# Vivado block design design_1, xczu28dr-ffvg1517-2-e, Vivado 2021.1
# (continued, part 4 of 8)
current_bd_instance /chan4/psb_out_post

# ---- hierarchy /chan4/fine_nco ----
current_bd_instance /chan4/fine_nco
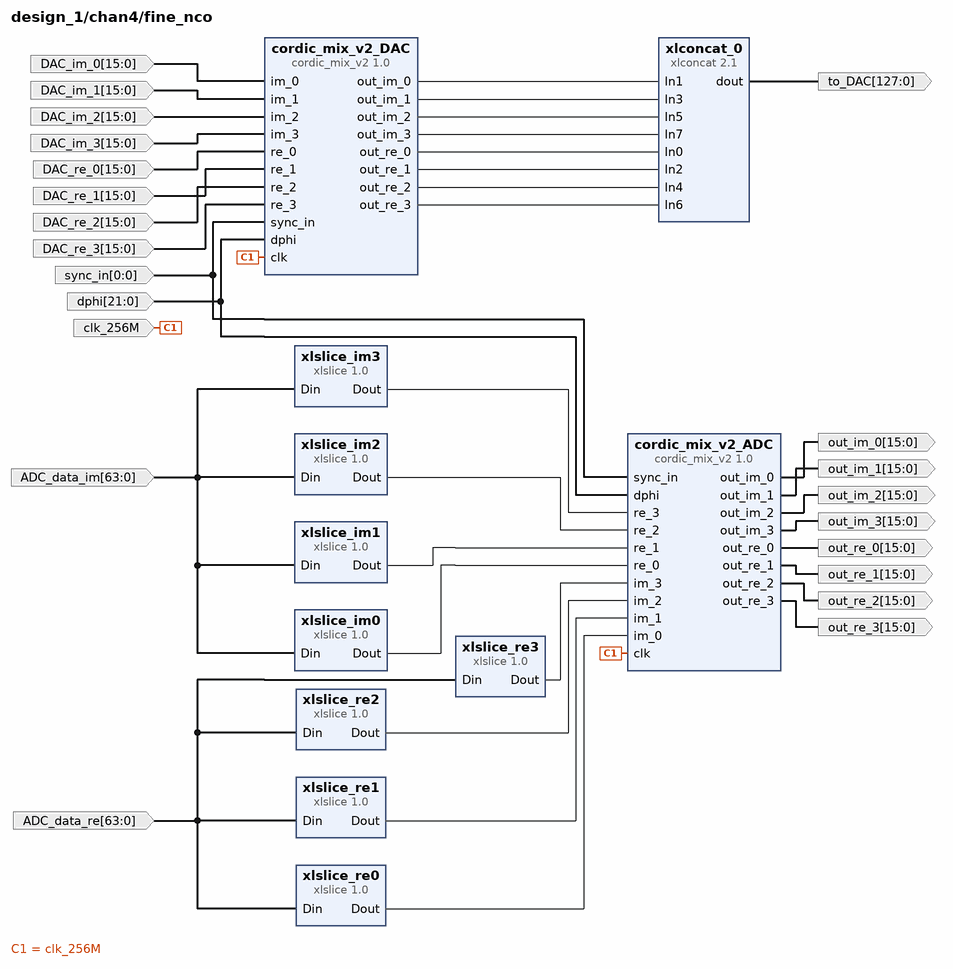
[diagram p30: block diagram inside /chan4/fine_nco]
create_bd_pin -dir I -from 63 -to 0 ADC_data_im
create_bd_pin -dir O -from 127 -to 0 to_DAC
create_bd_pin -dir I -from 63 -to 0 ADC_data_re
create_bd_pin -dir I -from 21 -to 0 dphi
create_bd_pin -dir I -from 0 -to 0 sync_in
create_bd_pin -dir I -type clk clk_256M
create_bd_pin -dir O -from 15 -to 0 out_im_0
create_bd_pin -dir O -from 15 -to 0 out_im_1
create_bd_pin -dir O -from 15 -to 0 out_im_2
create_bd_pin -dir O -from 15 -to 0 out_im_3
create_bd_pin -dir O -from 15 -to 0 out_re_0
create_bd_pin -dir O -from 15 -to 0 out_re_1
create_bd_pin -dir O -from 15 -to 0 out_re_2
create_bd_pin -dir O -from 15 -to 0 out_re_3
create_bd_pin -dir I -from 15 -to 0 DAC_im_0
create_bd_pin -dir I -from 15 -to 0 DAC_im_1
create_bd_pin -dir I -from 15 -to 0 DAC_im_2
create_bd_pin -dir I -from 15 -to 0 DAC_im_3
create_bd_pin -dir I -from 15 -to 0 DAC_re_0
create_bd_pin -dir I -from 15 -to 0 DAC_re_1
create_bd_pin -dir I -from 15 -to 0 DAC_re_2
create_bd_pin -dir I -from 15 -to 0 DAC_re_3

create_bd_cell -type ip -vlnv xilinx.com:ip:xlslice:1.0 xlslice_im0
set_property -dict {CONFIG.DIN_FROM 15 CONFIG.DIN_TO 0 CONFIG.DIN_WIDTH 64 CONFIG.DOUT_WIDTH 16} [get_bd_cells xlslice_im0]
create_bd_cell -type ip -vlnv xilinx.com:ip:xlslice:1.0 xlslice_im1
set_property -dict {CONFIG.DIN_FROM 31 CONFIG.DIN_TO 16 CONFIG.DIN_WIDTH 64 CONFIG.DOUT_WIDTH 16} [get_bd_cells xlslice_im1]
create_bd_cell -type ip -vlnv xilinx.com:ip:xlslice:1.0 xlslice_im2
set_property -dict {CONFIG.DIN_FROM 47 CONFIG.DIN_TO 32 CONFIG.DIN_WIDTH 64 CONFIG.DOUT_WIDTH 16} [get_bd_cells xlslice_im2]
create_bd_cell -type ip -vlnv xilinx.com:ip:xlconcat:2.1 xlconcat_0
set_property -dict [list \
  CONFIG.IN2_WIDTH 16 \
  CONFIG.IN3_WIDTH 16 \
  CONFIG.IN4_WIDTH 16 \
  CONFIG.IN5_WIDTH 16 \
  CONFIG.IN6_WIDTH 16 \
  CONFIG.IN7_WIDTH 16 \
  CONFIG.NUM_PORTS 8 \
] [get_bd_cells xlconcat_0]
create_bd_cell -type ip -vlnv xilinx.com:ip:xlslice:1.0 xlslice_re0
set_property -dict {CONFIG.DIN_FROM 15 CONFIG.DIN_TO 0 CONFIG.DIN_WIDTH 64 CONFIG.DOUT_WIDTH 16} [get_bd_cells xlslice_re0]
create_bd_cell -type ip -vlnv xilinx.com:ip:xlslice:1.0 xlslice_im3
set_property -dict {CONFIG.DIN_FROM 63 CONFIG.DIN_TO 48 CONFIG.DIN_WIDTH 64 CONFIG.DOUT_WIDTH 16} [get_bd_cells xlslice_im3]
create_bd_cell -type ip -vlnv xilinx.com:ip:xlslice:1.0 xlslice_re1
set_property -dict {CONFIG.DIN_FROM 31 CONFIG.DIN_TO 16 CONFIG.DIN_WIDTH 64 CONFIG.DOUT_WIDTH 16} [get_bd_cells xlslice_re1]
create_bd_cell -type ip -vlnv xilinx.com:ip:xlslice:1.0 xlslice_re2
set_property -dict {CONFIG.DIN_FROM 47 CONFIG.DIN_TO 32 CONFIG.DIN_WIDTH 64 CONFIG.DOUT_WIDTH 16} [get_bd_cells xlslice_re2]
create_bd_cell -type ip -vlnv xilinx.com:user:cordic_mix_v2:1.0 cordic_mix_v2_ADC
create_bd_cell -type ip -vlnv xilinx.com:user:cordic_mix_v2:1.0 cordic_mix_v2_DAC
create_bd_cell -type ip -vlnv xilinx.com:ip:xlslice:1.0 xlslice_re3
set_property -dict {CONFIG.DIN_FROM 63 CONFIG.DIN_TO 48 CONFIG.DIN_WIDTH 64 CONFIG.DOUT_WIDTH 16} [get_bd_cells xlslice_re3]

# ---- hierarchy /chan4/overflow_management ----
current_bd_instance /chan4/overflow_management
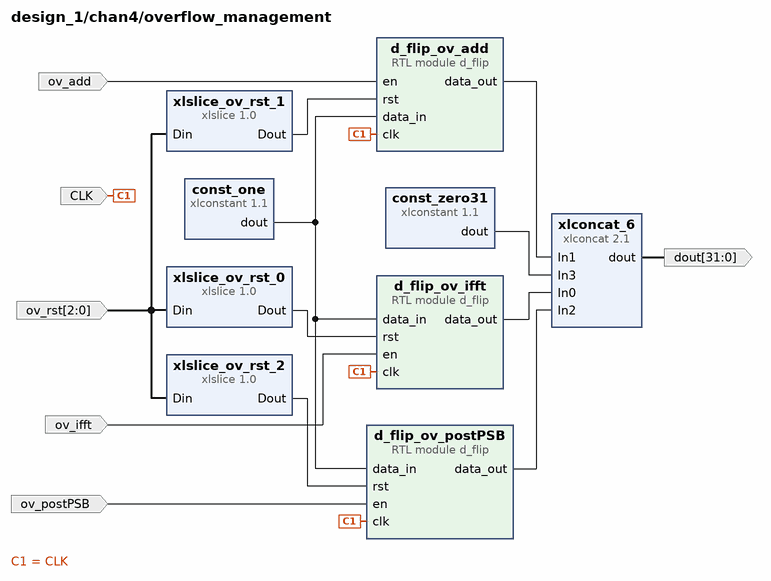
[diagram p31: block diagram inside /chan4/overflow_management]
create_bd_pin -dir I -type clk CLK
create_bd_pin -dir O -from 31 -to 0 dout
create_bd_pin -dir I ov_add
create_bd_pin -dir I ov_ifft
create_bd_pin -dir I ov_postPSB
create_bd_pin -dir I -from 2 -to 0 ov_rst

create_bd_cell -type ip -vlnv xilinx.com:ip:xlconstant:1.1 const_one
set_property -dict {CONFIG.CONST_VAL 1 CONFIG.CONST_WIDTH 1} [get_bd_cells const_one]
create_bd_cell -type ip -vlnv xilinx.com:ip:xlconstant:1.1 const_zero31
set_property -dict {CONFIG.CONST_VAL 0 CONFIG.CONST_WIDTH 29} [get_bd_cells const_zero31]
create_bd_cell -type module -reference d_flip d_flip_ov_add
set_property -dict {CONFIG.width 1} [get_bd_cells d_flip_ov_add]
create_bd_cell -type module -reference d_flip d_flip_ov_ifft
set_property -dict {CONFIG.width 1} [get_bd_cells d_flip_ov_ifft]
create_bd_cell -type module -reference d_flip d_flip_ov_postPSB
set_property -dict {CONFIG.width 1} [get_bd_cells d_flip_ov_postPSB]
create_bd_cell -type ip -vlnv xilinx.com:ip:xlconcat:2.1 xlconcat_6
set_property -dict [list \
  CONFIG.IN0_WIDTH 1 \
  CONFIG.IN1_WIDTH 1 \
  CONFIG.IN2_WIDTH 1 \
  CONFIG.IN3_WIDTH 29 \
  CONFIG.IN4_WIDTH 16 \
  CONFIG.IN5_WIDTH 16 \
  CONFIG.IN6_WIDTH 16 \
  CONFIG.IN7_WIDTH 16 \
  CONFIG.NUM_PORTS 4 \
] [get_bd_cells xlconcat_6]
create_bd_cell -type ip -vlnv xilinx.com:ip:xlslice:1.0 xlslice_ov_rst_0
set_property -dict {CONFIG.DIN_FROM 0 CONFIG.DIN_TO 0 CONFIG.DIN_WIDTH 3 CONFIG.DOUT_WIDTH 1} [get_bd_cells xlslice_ov_rst_0]
create_bd_cell -type ip -vlnv xilinx.com:ip:xlslice:1.0 xlslice_ov_rst_1
set_property -dict {CONFIG.DIN_FROM 1 CONFIG.DIN_TO 1 CONFIG.DIN_WIDTH 3 CONFIG.DOUT_WIDTH 1} [get_bd_cells xlslice_ov_rst_1]
create_bd_cell -type ip -vlnv xilinx.com:ip:xlslice:1.0 xlslice_ov_rst_2
set_property -dict {CONFIG.DIN_FROM 2 CONFIG.DIN_TO 2 CONFIG.DIN_WIDTH 3 CONFIG.DOUT_WIDTH 1} [get_bd_cells xlslice_ov_rst_2]

# ---- hierarchy /ethWrapPort1 ----
current_bd_instance /ethWrapPort1
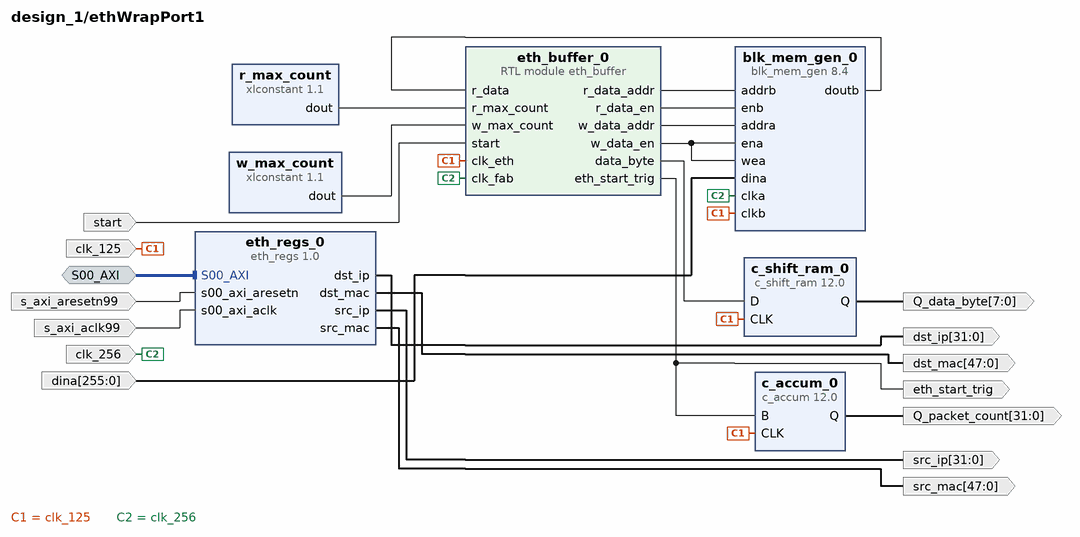
[diagram p32: block diagram inside /ethWrapPort1]
create_bd_intf_pin -mode Slave -vlnv xilinx.com:interface:aximm_rtl:1.0 S00_AXI
create_bd_pin -dir I start
create_bd_pin -dir I -type clk clk_256
create_bd_pin -dir I -type clk clk_125
create_bd_pin -dir I -type rst s_axi_aresetn99
create_bd_pin -dir O eth_start_trig
create_bd_pin -dir O -from 31 -to 0 src_ip
create_bd_pin -dir O -from 47 -to 0 src_mac
create_bd_pin -dir O -from 31 -to 0 dst_ip
create_bd_pin -dir O -from 47 -to 0 dst_mac
create_bd_pin -dir O -from 7 -to 0 -type data Q_data_byte
create_bd_pin -dir O -from 31 -to 0 -type data Q_packet_count
create_bd_pin -dir I s_axi_aclk99
create_bd_pin -dir I -from 255 -to 0 dina

create_bd_cell -type ip -vlnv xilinx.com:ip:xlconstant:1.1 w_max_count
set_property -dict {CONFIG.CONST_VAL 512 CONFIG.CONST_WIDTH 10} [get_bd_cells w_max_count]
create_bd_cell -type ip -vlnv xilinx.com:ip:blk_mem_gen:8.4 blk_mem_gen_0
set_property -dict [list \
  CONFIG.Enable_32bit_Address false \
  CONFIG.Enable_B Use_ENB_Pin \
  CONFIG.Memory_Type Simple_Dual_Port_RAM \
  CONFIG.Operating_Mode_A NO_CHANGE \
  CONFIG.Port_B_Clock 100 \
  CONFIG.Port_B_Enable_Rate 100 \
  CONFIG.Read_Width_B 256 \
  CONFIG.Register_PortB_Output_of_Memory_Primitives true \
  CONFIG.Use_Byte_Write_Enable false \
  CONFIG.Write_Depth_A 1024 \
  CONFIG.Write_Width_A 256 \
  CONFIG.Write_Width_B 256 \
  CONFIG.use_bram_block Stand_Alone \
] [get_bd_cells blk_mem_gen_0]
create_bd_cell -type ip -vlnv xilinx.com:ip:xlconstant:1.1 r_max_count
set_property -dict {CONFIG.CONST_VAL 16383 CONFIG.CONST_WIDTH 15} [get_bd_cells r_max_count]
create_bd_cell -type ip -vlnv xilinx.com:ip:c_shift_ram:12.0 c_shift_ram_0
set_property -dict [list \
  CONFIG.AsyncInitVal 00000000 \
  CONFIG.DefaultData 00000000 \
  CONFIG.Depth 42 \
  CONFIG.Width 8 \
] [get_bd_cells c_shift_ram_0]
create_bd_cell -type ip -vlnv xilinx.com:ip:c_accum:12.0 c_accum_0
set_property -dict [list \
  CONFIG.Bypass false \
  CONFIG.Input_Type Unsigned \
  CONFIG.Input_Width 1 \
  CONFIG.Output_Width 32 \
] [get_bd_cells c_accum_0]
create_bd_cell -type ip -vlnv user.org:user:eth_regs:1.0 eth_regs_0
create_bd_cell -type module -reference eth_buffer eth_buffer_0

# ---- hierarchy /ethWrapPort2 ----
current_bd_instance /ethWrapPort2
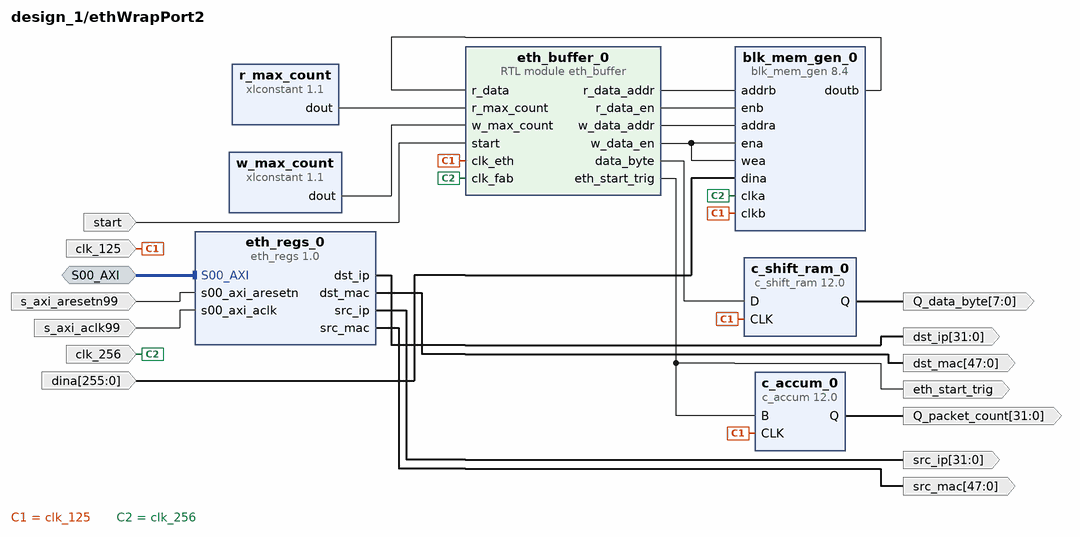
[diagram p33: block diagram inside /ethWrapPort2]
create_bd_intf_pin -mode Slave -vlnv xilinx.com:interface:aximm_rtl:1.0 S00_AXI
create_bd_pin -dir I start
create_bd_pin -dir I -type clk clk_256
create_bd_pin -dir I -type clk clk_125
create_bd_pin -dir I -type rst s_axi_aresetn99
create_bd_pin -dir O eth_start_trig
create_bd_pin -dir O -from 31 -to 0 src_ip
create_bd_pin -dir O -from 47 -to 0 src_mac
create_bd_pin -dir O -from 31 -to 0 dst_ip
create_bd_pin -dir O -from 47 -to 0 dst_mac
create_bd_pin -dir O -from 7 -to 0 -type data Q_data_byte
create_bd_pin -dir O -from 31 -to 0 -type data Q_packet_count
create_bd_pin -dir I s_axi_aclk99
create_bd_pin -dir I -from 255 -to 0 dina

create_bd_cell -type ip -vlnv xilinx.com:ip:xlconstant:1.1 w_max_count
set_property -dict {CONFIG.CONST_VAL 512 CONFIG.CONST_WIDTH 10} [get_bd_cells w_max_count]
create_bd_cell -type ip -vlnv xilinx.com:ip:blk_mem_gen:8.4 blk_mem_gen_0
set_property -dict [list \
  CONFIG.Enable_32bit_Address false \
  CONFIG.Enable_B Use_ENB_Pin \
  CONFIG.Memory_Type Simple_Dual_Port_RAM \
  CONFIG.Operating_Mode_A NO_CHANGE \
  CONFIG.Port_B_Clock 100 \
  CONFIG.Port_B_Enable_Rate 100 \
  CONFIG.Read_Width_B 256 \
  CONFIG.Register_PortB_Output_of_Memory_Primitives true \
  CONFIG.Use_Byte_Write_Enable false \
  CONFIG.Write_Depth_A 1024 \
  CONFIG.Write_Width_A 256 \
  CONFIG.Write_Width_B 256 \
  CONFIG.use_bram_block Stand_Alone \
] [get_bd_cells blk_mem_gen_0]
create_bd_cell -type ip -vlnv xilinx.com:ip:xlconstant:1.1 r_max_count
set_property -dict {CONFIG.CONST_VAL 16383 CONFIG.CONST_WIDTH 15} [get_bd_cells r_max_count]
create_bd_cell -type ip -vlnv xilinx.com:ip:c_shift_ram:12.0 c_shift_ram_0
set_property -dict [list \
  CONFIG.AsyncInitVal 00000000 \
  CONFIG.DefaultData 00000000 \
  CONFIG.Depth 42 \
  CONFIG.Width 8 \
] [get_bd_cells c_shift_ram_0]
create_bd_cell -type ip -vlnv xilinx.com:ip:c_accum:12.0 c_accum_0
set_property -dict [list \
  CONFIG.Bypass false \
  CONFIG.Input_Type Unsigned \
  CONFIG.Input_Width 1 \
  CONFIG.Output_Width 32 \
] [get_bd_cells c_accum_0]
create_bd_cell -type ip -vlnv user.org:user:eth_regs:1.0 eth_regs_0
create_bd_cell -type module -reference eth_buffer eth_buffer_0

# ---- hierarchy /ethWrapPort3 ----
current_bd_instance /ethWrapPort3
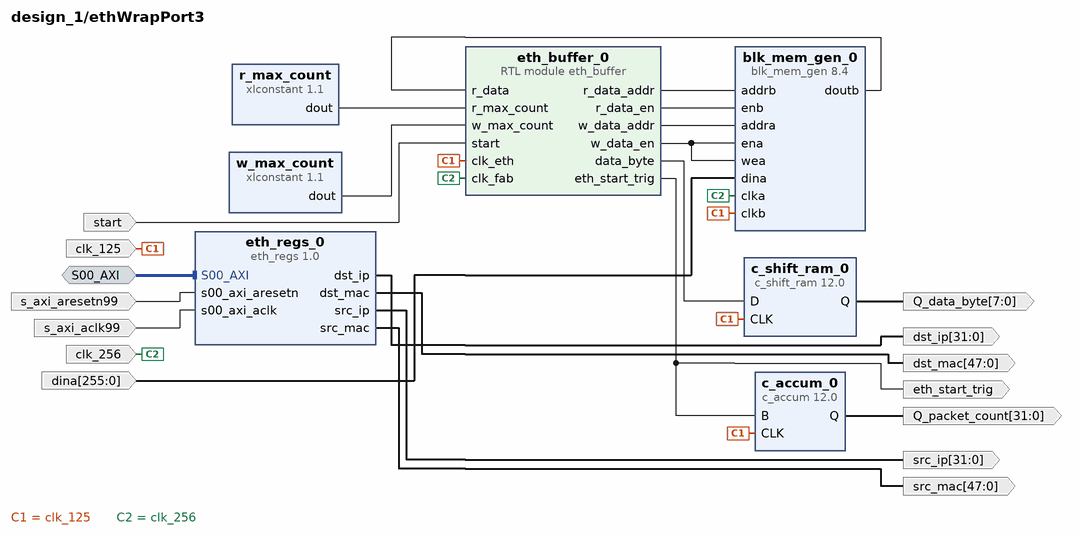
[diagram p34: block diagram inside /ethWrapPort3]
create_bd_intf_pin -mode Slave -vlnv xilinx.com:interface:aximm_rtl:1.0 S00_AXI
create_bd_pin -dir I start
create_bd_pin -dir I -type clk clk_256
create_bd_pin -dir I -type clk clk_125
create_bd_pin -dir I -type rst s_axi_aresetn99
create_bd_pin -dir O eth_start_trig
create_bd_pin -dir O -from 31 -to 0 src_ip
create_bd_pin -dir O -from 47 -to 0 src_mac
create_bd_pin -dir O -from 31 -to 0 dst_ip
create_bd_pin -dir O -from 47 -to 0 dst_mac
create_bd_pin -dir O -from 7 -to 0 -type data Q_data_byte
create_bd_pin -dir O -from 31 -to 0 -type data Q_packet_count
create_bd_pin -dir I s_axi_aclk99
create_bd_pin -dir I -from 255 -to 0 dina

create_bd_cell -type ip -vlnv xilinx.com:ip:xlconstant:1.1 w_max_count
set_property -dict {CONFIG.CONST_VAL 512 CONFIG.CONST_WIDTH 10} [get_bd_cells w_max_count]
create_bd_cell -type ip -vlnv xilinx.com:ip:blk_mem_gen:8.4 blk_mem_gen_0
set_property -dict [list \
  CONFIG.Enable_32bit_Address false \
  CONFIG.Enable_B Use_ENB_Pin \
  CONFIG.Memory_Type Simple_Dual_Port_RAM \
  CONFIG.Operating_Mode_A NO_CHANGE \
  CONFIG.Port_B_Clock 100 \
  CONFIG.Port_B_Enable_Rate 100 \
  CONFIG.Read_Width_B 256 \
  CONFIG.Register_PortB_Output_of_Memory_Primitives true \
  CONFIG.Use_Byte_Write_Enable false \
  CONFIG.Write_Depth_A 1024 \
  CONFIG.Write_Width_A 256 \
  CONFIG.Write_Width_B 256 \
  CONFIG.use_bram_block Stand_Alone \
] [get_bd_cells blk_mem_gen_0]
create_bd_cell -type ip -vlnv xilinx.com:ip:xlconstant:1.1 r_max_count
set_property -dict {CONFIG.CONST_VAL 16383 CONFIG.CONST_WIDTH 15} [get_bd_cells r_max_count]
create_bd_cell -type ip -vlnv xilinx.com:ip:c_shift_ram:12.0 c_shift_ram_0
set_property -dict [list \
  CONFIG.AsyncInitVal 00000000 \
  CONFIG.DefaultData 00000000 \
  CONFIG.Depth 42 \
  CONFIG.Width 8 \
] [get_bd_cells c_shift_ram_0]
create_bd_cell -type ip -vlnv xilinx.com:ip:c_accum:12.0 c_accum_0
set_property -dict [list \
  CONFIG.Bypass false \
  CONFIG.Input_Type Unsigned \
  CONFIG.Input_Width 1 \
  CONFIG.Output_Width 32 \
] [get_bd_cells c_accum_0]
create_bd_cell -type ip -vlnv user.org:user:eth_regs:1.0 eth_regs_0
create_bd_cell -type module -reference eth_buffer eth_buffer_0

# ---- hierarchy /udp_control ----
current_bd_instance /udp_control
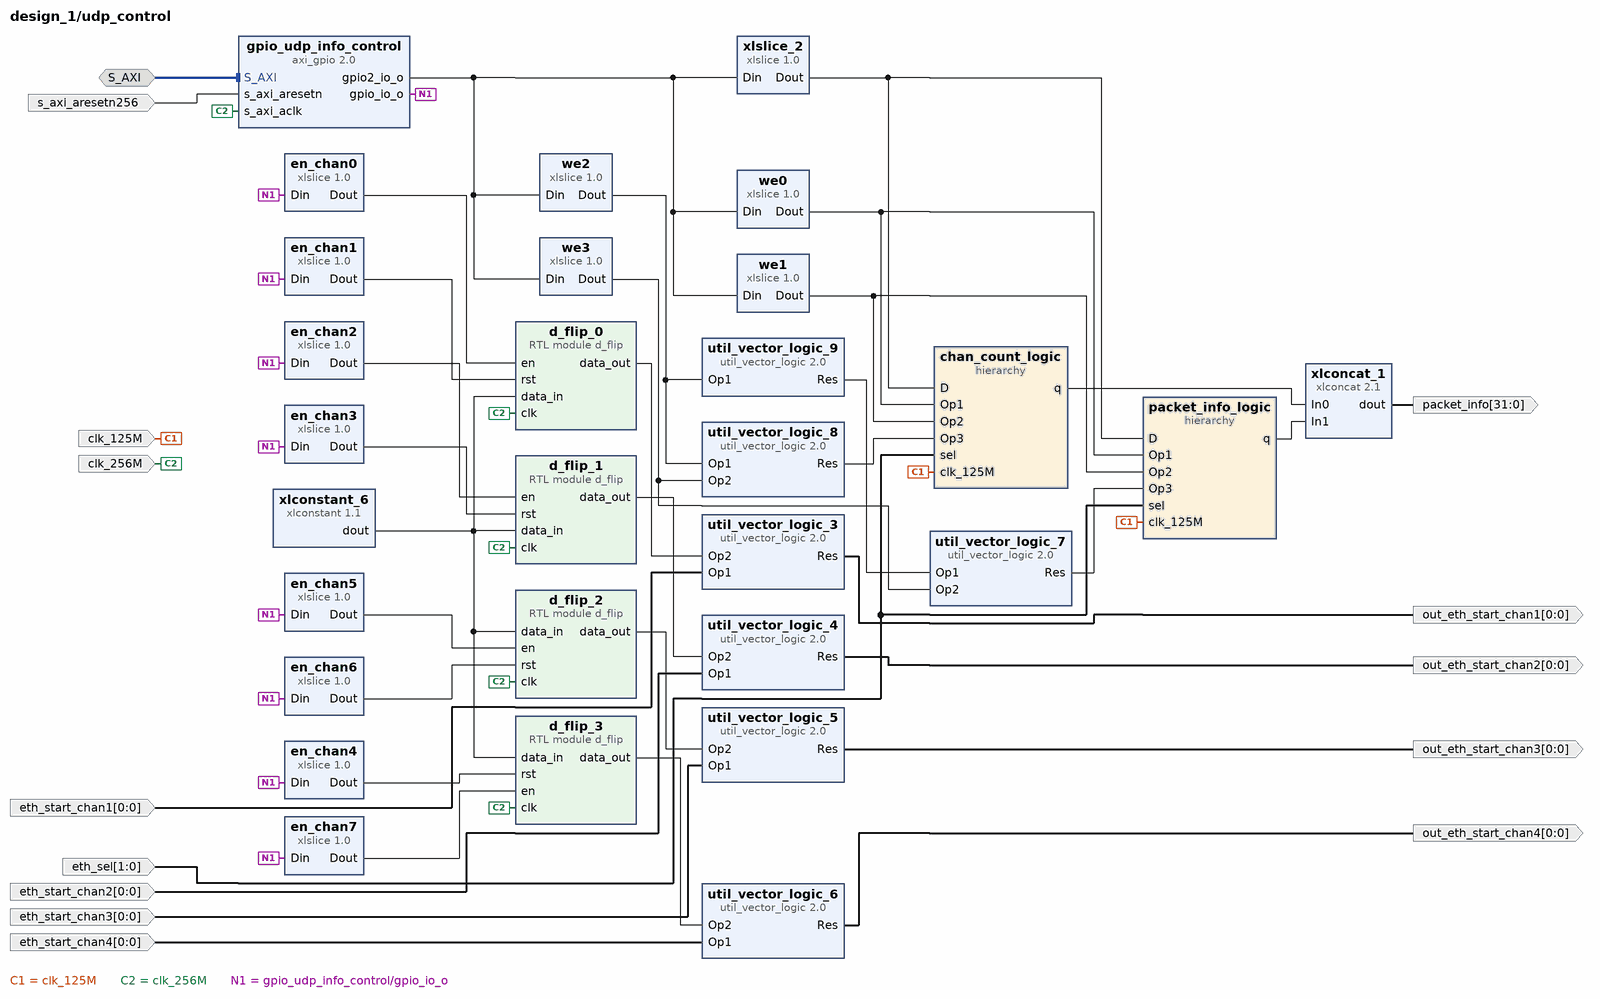
[diagram p35: block diagram inside /udp_control]
create_bd_intf_pin -mode Slave -vlnv xilinx.com:interface:aximm_rtl:1.0 S_AXI
create_bd_pin -dir I -type clk clk_256M
create_bd_pin -dir O -from 31 -to 0 packet_info
create_bd_pin -dir I -from 0 -to 0 eth_start_chan1
create_bd_pin -dir O -from 0 -to 0 out_eth_start_chan1
create_bd_pin -dir I -from 0 -to 0 eth_start_chan2
create_bd_pin -dir O -from 0 -to 0 out_eth_start_chan2
create_bd_pin -dir I -from 0 -to 0 eth_start_chan3
create_bd_pin -dir O -from 0 -to 0 out_eth_start_chan3
create_bd_pin -dir I -type rst s_axi_aresetn256
create_bd_pin -dir I -from 0 -to 0 eth_start_chan4
create_bd_pin -dir O -from 0 -to 0 out_eth_start_chan4
create_bd_pin -dir I -from 1 -to 0 eth_sel
create_bd_pin -dir I -type clk clk_125M

create_bd_cell -type ip -vlnv xilinx.com:ip:xlslice:1.0 en_chan7
set_property -dict {CONFIG.DIN_FROM 6 CONFIG.DIN_TO 6 CONFIG.DOUT_WIDTH 1} [get_bd_cells en_chan7]
create_bd_cell -type ip -vlnv xilinx.com:ip:xlslice:1.0 we1
set_property -dict {CONFIG.DIN_FROM 17 CONFIG.DIN_TO 17 CONFIG.DOUT_WIDTH 1} [get_bd_cells we1]
create_bd_cell -type ip -vlnv xilinx.com:ip:xlslice:1.0 we2
set_property -dict {CONFIG.DIN_FROM 18 CONFIG.DIN_TO 18 CONFIG.DOUT_WIDTH 1} [get_bd_cells we2]
create_bd_cell -type ip -vlnv xilinx.com:ip:xlslice:1.0 we3
set_property -dict {CONFIG.DIN_FROM 19 CONFIG.DIN_TO 19 CONFIG.DOUT_WIDTH 1} [get_bd_cells we3]
create_bd_cell -type ip -vlnv xilinx.com:ip:xlconcat:2.1 xlconcat_1
set_property -dict {CONFIG.IN0_WIDTH 16 CONFIG.IN1_WIDTH 16} [get_bd_cells xlconcat_1]
create_bd_cell -type ip -vlnv xilinx.com:ip:xlslice:1.0 xlslice_2
set_property -dict {CONFIG.DIN_FROM 15 CONFIG.DOUT_WIDTH 16} [get_bd_cells xlslice_2]
create_bd_cell -type ip -vlnv xilinx.com:ip:util_vector_logic:2.0 util_vector_logic_3
set_property -dict {CONFIG.C_OPERATION and CONFIG.C_SIZE 1} [get_bd_cells util_vector_logic_3]
create_bd_cell -type ip -vlnv xilinx.com:ip:xlslice:1.0 en_chan0
set_property -dict {CONFIG.DIN_FROM 0 CONFIG.DOUT_WIDTH 1} [get_bd_cells en_chan0]
create_bd_cell -type ip -vlnv xilinx.com:ip:xlslice:1.0 en_chan1
set_property -dict {CONFIG.DIN_FROM 1 CONFIG.DIN_TO 1 CONFIG.DOUT_WIDTH 1} [get_bd_cells en_chan1]
create_bd_cell -type ip -vlnv xilinx.com:ip:util_vector_logic:2.0 util_vector_logic_4
set_property -dict {CONFIG.C_OPERATION and CONFIG.C_SIZE 1} [get_bd_cells util_vector_logic_4]
create_bd_cell -type ip -vlnv xilinx.com:ip:util_vector_logic:2.0 util_vector_logic_5
set_property -dict {CONFIG.C_OPERATION and CONFIG.C_SIZE 1} [get_bd_cells util_vector_logic_5]
create_bd_cell -type ip -vlnv xilinx.com:ip:xlslice:1.0 en_chan2
set_property -dict {CONFIG.DIN_FROM 2 CONFIG.DIN_TO 2 CONFIG.DOUT_WIDTH 1} [get_bd_cells en_chan2]
create_bd_cell -type ip -vlnv xilinx.com:ip:xlslice:1.0 en_chan3
set_property -dict {CONFIG.DIN_FROM 3 CONFIG.DIN_TO 3 CONFIG.DOUT_WIDTH 1} [get_bd_cells en_chan3]
create_bd_cell -type ip -vlnv xilinx.com:ip:util_vector_logic:2.0 util_vector_logic_7
set_property -dict {CONFIG.C_SIZE 1} [get_bd_cells util_vector_logic_7]
create_bd_cell -type ip -vlnv xilinx.com:ip:xlslice:1.0 en_chan4
set_property -dict {CONFIG.DIN_FROM 7 CONFIG.DIN_TO 7 CONFIG.DOUT_WIDTH 1} [get_bd_cells en_chan4]
create_bd_cell -type ip -vlnv xilinx.com:ip:xlconstant:1.1 xlconstant_6
create_bd_cell -type ip -vlnv xilinx.com:ip:xlslice:1.0 en_chan5
set_property -dict {CONFIG.DIN_FROM 4 CONFIG.DIN_TO 4 CONFIG.DOUT_WIDTH 1} [get_bd_cells en_chan5]
create_bd_cell -type ip -vlnv xilinx.com:ip:util_vector_logic:2.0 util_vector_logic_8
set_property -dict {CONFIG.C_SIZE 1} [get_bd_cells util_vector_logic_8]
create_bd_cell -type ip -vlnv xilinx.com:ip:util_vector_logic:2.0 util_vector_logic_9
set_property -dict {CONFIG.C_OPERATION not CONFIG.C_SIZE 1} [get_bd_cells util_vector_logic_9]
create_bd_cell -type ip -vlnv xilinx.com:ip:axi_gpio:2.0 gpio_udp_info_control
set_property -dict {CONFIG.C_ALL_OUTPUTS 1 CONFIG.C_ALL_OUTPUTS_2 1 CONFIG.C_IS_DUAL 1} [get_bd_cells gpio_udp_info_control]
create_bd_cell -type ip -vlnv xilinx.com:ip:xlslice:1.0 en_chan6
set_property -dict {CONFIG.DIN_FROM 5 CONFIG.DIN_TO 5 CONFIG.DOUT_WIDTH 1} [get_bd_cells en_chan6]
create_bd_cell -type ip -vlnv xilinx.com:ip:util_vector_logic:2.0 util_vector_logic_6
set_property -dict {CONFIG.C_OPERATION and CONFIG.C_SIZE 1} [get_bd_cells util_vector_logic_6]
create_bd_cell -type hier chan_count_logic
create_bd_cell -type hier packet_info_logic
create_bd_cell -type ip -vlnv xilinx.com:ip:xlslice:1.0 we0
set_property -dict {CONFIG.DIN_FROM 16 CONFIG.DIN_TO 16 CONFIG.DOUT_WIDTH 1} [get_bd_cells we0]
create_bd_cell -type module -reference d_flip d_flip_0
set_property -dict {CONFIG.width 1} [get_bd_cells d_flip_0]
create_bd_cell -type module -reference d_flip d_flip_1
set_property -dict {CONFIG.width 1} [get_bd_cells d_flip_1]
create_bd_cell -type module -reference d_flip d_flip_2
set_property -dict {CONFIG.width 1} [get_bd_cells d_flip_2]
create_bd_cell -type module -reference d_flip d_flip_3
set_property -dict {CONFIG.width 1} [get_bd_cells d_flip_3]

# ---- hierarchy /udp_control/chan_count_logic ----
current_bd_instance /udp_control/chan_count_logic
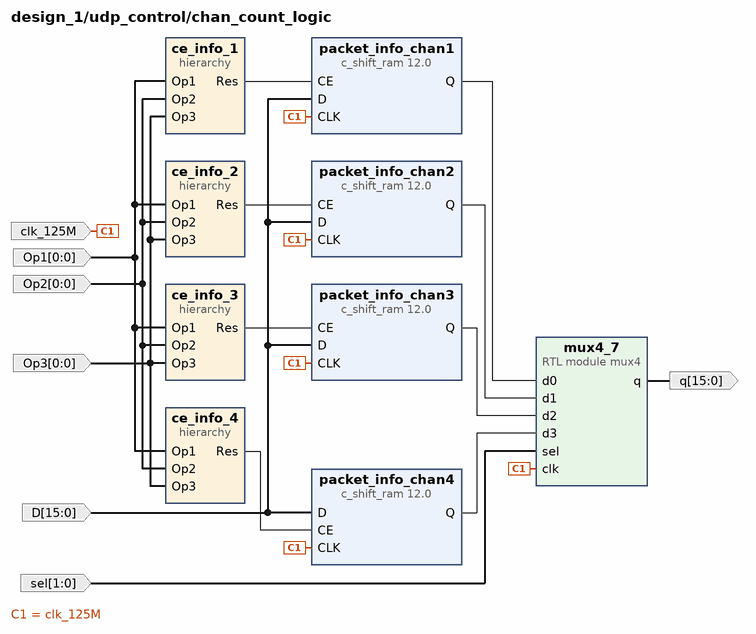
[diagram p36: block diagram inside /udp_control/chan_count_logic]
create_bd_pin -dir I -from 15 -to 0 -type data D
create_bd_pin -dir O -from 15 -to 0 q
create_bd_pin -dir I -from 0 -to 0 Op1
create_bd_pin -dir I -from 0 -to 0 Op2
create_bd_pin -dir I -from 0 -to 0 Op3
create_bd_pin -dir I -from 1 -to 0 sel
create_bd_pin -dir I -type clk clk_125M

create_bd_cell -type ip -vlnv xilinx.com:ip:c_shift_ram:12.0 packet_info_chan1
set_property -dict {CONFIG.CE true CONFIG.Depth 1} [get_bd_cells packet_info_chan1]
create_bd_cell -type ip -vlnv xilinx.com:ip:c_shift_ram:12.0 packet_info_chan2
set_property -dict {CONFIG.CE true CONFIG.Depth 1} [get_bd_cells packet_info_chan2]
create_bd_cell -type ip -vlnv xilinx.com:ip:c_shift_ram:12.0 packet_info_chan3
set_property -dict {CONFIG.CE true CONFIG.Depth 1} [get_bd_cells packet_info_chan3]
create_bd_cell -type ip -vlnv xilinx.com:ip:c_shift_ram:12.0 packet_info_chan4
set_property -dict {CONFIG.CE true CONFIG.Depth 1} [get_bd_cells packet_info_chan4]
create_bd_cell -type hier ce_info_1
create_bd_cell -type hier ce_info_2
create_bd_cell -type hier ce_info_3
create_bd_cell -type hier ce_info_4
create_bd_cell -type module -reference mux4 mux4_7
set_property -dict {CONFIG.width 16} [get_bd_cells mux4_7]

# ---- hierarchy /udp_control/chan_count_logic/ce_info_1 ----
current_bd_instance /udp_control/chan_count_logic/ce_info_1
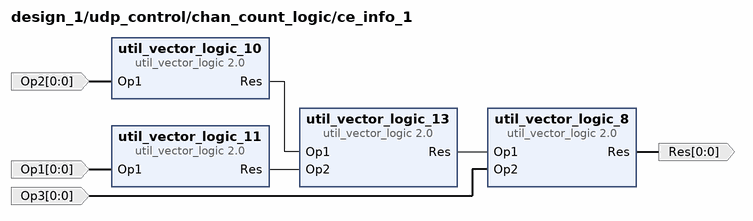
[diagram p37: block diagram inside /udp_control/chan_count_logic/ce_info_1]
create_bd_pin -dir O -from 0 -to 0 Res
create_bd_pin -dir I -from 0 -to 0 Op1
create_bd_pin -dir I -from 0 -to 0 Op2
create_bd_pin -dir I -from 0 -to 0 Op3

create_bd_cell -type ip -vlnv xilinx.com:ip:util_vector_logic:2.0 util_vector_logic_13
set_property -dict {CONFIG.C_OPERATION and CONFIG.C_SIZE 1} [get_bd_cells util_vector_logic_13]
create_bd_cell -type ip -vlnv xilinx.com:ip:util_vector_logic:2.0 util_vector_logic_8
set_property -dict {CONFIG.C_OPERATION and CONFIG.C_SIZE 1} [get_bd_cells util_vector_logic_8]
create_bd_cell -type ip -vlnv xilinx.com:ip:util_vector_logic:2.0 util_vector_logic_10
set_property -dict {CONFIG.C_OPERATION not CONFIG.C_SIZE 1} [get_bd_cells util_vector_logic_10]
create_bd_cell -type ip -vlnv xilinx.com:ip:util_vector_logic:2.0 util_vector_logic_11
set_property -dict {CONFIG.C_OPERATION not CONFIG.C_SIZE 1} [get_bd_cells util_vector_logic_11]

# ---- hierarchy /udp_control/chan_count_logic/ce_info_2 ----
current_bd_instance /udp_control/chan_count_logic/ce_info_2
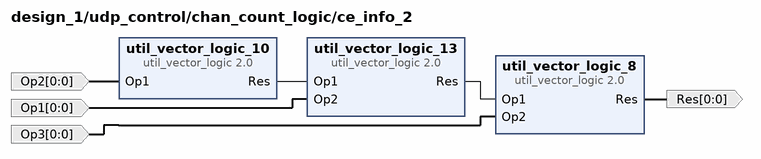
[diagram p38: block diagram inside /udp_control/chan_count_logic/ce_info_2]
create_bd_pin -dir O -from 0 -to 0 Res
create_bd_pin -dir I -from 0 -to 0 Op1
create_bd_pin -dir I -from 0 -to 0 Op2
create_bd_pin -dir I -from 0 -to 0 Op3

create_bd_cell -type ip -vlnv xilinx.com:ip:util_vector_logic:2.0 util_vector_logic_13
set_property -dict {CONFIG.C_OPERATION and CONFIG.C_SIZE 1} [get_bd_cells util_vector_logic_13]
create_bd_cell -type ip -vlnv xilinx.com:ip:util_vector_logic:2.0 util_vector_logic_8
set_property -dict {CONFIG.C_OPERATION and CONFIG.C_SIZE 1} [get_bd_cells util_vector_logic_8]
create_bd_cell -type ip -vlnv xilinx.com:ip:util_vector_logic:2.0 util_vector_logic_10
set_property -dict {CONFIG.C_OPERATION not CONFIG.C_SIZE 1} [get_bd_cells util_vector_logic_10]

# ---- hierarchy /udp_control/chan_count_logic/ce_info_3 ----
current_bd_instance /udp_control/chan_count_logic/ce_info_3
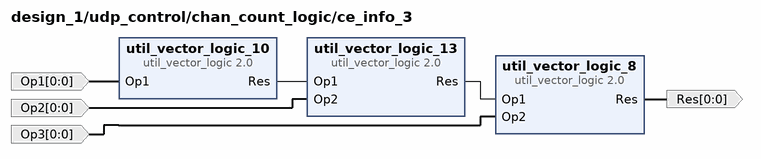
[diagram p39: block diagram inside /udp_control/chan_count_logic/ce_info_3]
create_bd_pin -dir O -from 0 -to 0 Res
create_bd_pin -dir I -from 0 -to 0 Op1
create_bd_pin -dir I -from 0 -to 0 Op2
create_bd_pin -dir I -from 0 -to 0 Op3

create_bd_cell -type ip -vlnv xilinx.com:ip:util_vector_logic:2.0 util_vector_logic_13
set_property -dict {CONFIG.C_OPERATION and CONFIG.C_SIZE 1} [get_bd_cells util_vector_logic_13]
create_bd_cell -type ip -vlnv xilinx.com:ip:util_vector_logic:2.0 util_vector_logic_8
set_property -dict {CONFIG.C_OPERATION and CONFIG.C_SIZE 1} [get_bd_cells util_vector_logic_8]
create_bd_cell -type ip -vlnv xilinx.com:ip:util_vector_logic:2.0 util_vector_logic_10
set_property -dict {CONFIG.C_OPERATION not CONFIG.C_SIZE 1} [get_bd_cells util_vector_logic_10]

# ---- hierarchy /udp_control/chan_count_logic/ce_info_4 ----
current_bd_instance /udp_control/chan_count_logic/ce_info_4
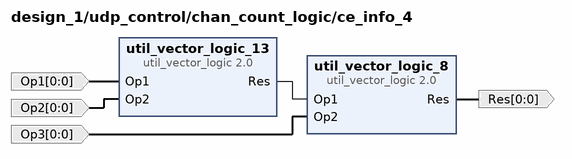
[diagram p40: block diagram inside /udp_control/chan_count_logic/ce_info_4]
create_bd_pin -dir O -from 0 -to 0 Res
create_bd_pin -dir I -from 0 -to 0 Op1
create_bd_pin -dir I -from 0 -to 0 Op2
create_bd_pin -dir I -from 0 -to 0 Op3

create_bd_cell -type ip -vlnv xilinx.com:ip:util_vector_logic:2.0 util_vector_logic_13
set_property -dict {CONFIG.C_OPERATION and CONFIG.C_SIZE 1} [get_bd_cells util_vector_logic_13]
create_bd_cell -type ip -vlnv xilinx.com:ip:util_vector_logic:2.0 util_vector_logic_8
set_property -dict {CONFIG.C_OPERATION and CONFIG.C_SIZE 1} [get_bd_cells util_vector_logic_8]

# ---- hierarchy /udp_control/packet_info_logic ----
current_bd_instance /udp_control/packet_info_logic
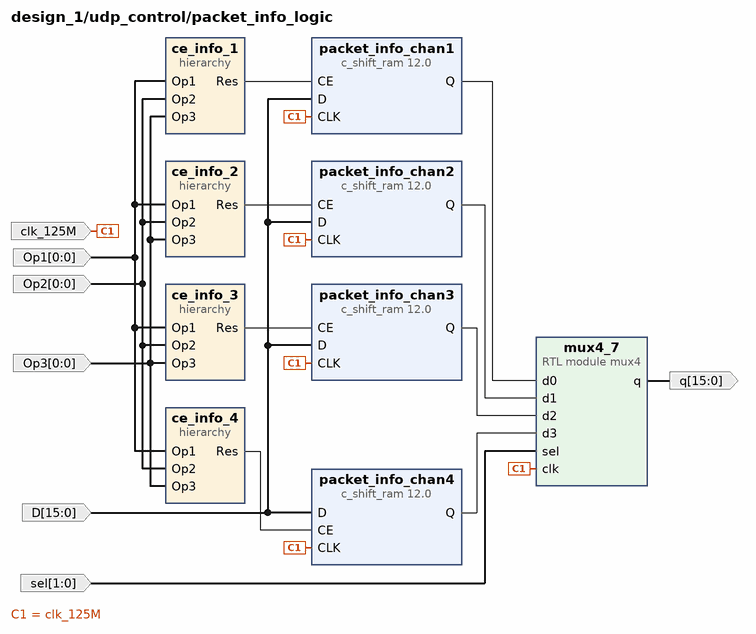
[diagram p41: block diagram inside /udp_control/packet_info_logic]
create_bd_pin -dir I -from 15 -to 0 -type data D
create_bd_pin -dir O -from 15 -to 0 q
create_bd_pin -dir I -from 0 -to 0 Op1
create_bd_pin -dir I -from 0 -to 0 Op2
create_bd_pin -dir I -from 0 -to 0 Op3
create_bd_pin -dir I -from 1 -to 0 sel
create_bd_pin -dir I -type clk clk_125M

create_bd_cell -type ip -vlnv xilinx.com:ip:c_shift_ram:12.0 packet_info_chan1
set_property -dict {CONFIG.CE true CONFIG.Depth 1} [get_bd_cells packet_info_chan1]
create_bd_cell -type ip -vlnv xilinx.com:ip:c_shift_ram:12.0 packet_info_chan2
set_property -dict {CONFIG.CE true CONFIG.Depth 1} [get_bd_cells packet_info_chan2]
create_bd_cell -type ip -vlnv xilinx.com:ip:c_shift_ram:12.0 packet_info_chan3
set_property -dict {CONFIG.CE true CONFIG.Depth 1} [get_bd_cells packet_info_chan3]
create_bd_cell -type ip -vlnv xilinx.com:ip:c_shift_ram:12.0 packet_info_chan4
set_property -dict {CONFIG.CE true CONFIG.Depth 1} [get_bd_cells packet_info_chan4]
create_bd_cell -type hier ce_info_1
create_bd_cell -type hier ce_info_2
create_bd_cell -type hier ce_info_3
create_bd_cell -type hier ce_info_4
create_bd_cell -type module -reference mux4 mux4_7
set_property -dict {CONFIG.width 16} [get_bd_cells mux4_7]

# ---- hierarchy /udp_control/packet_info_logic/ce_info_1 ----
current_bd_instance /udp_control/packet_info_logic/ce_info_1
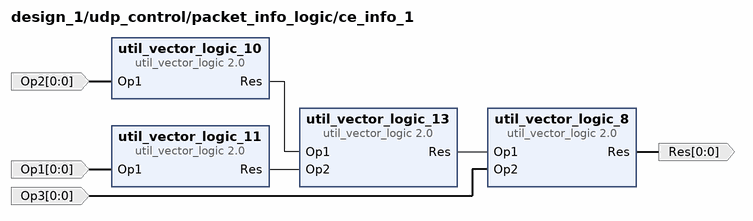
[diagram p42: block diagram inside /udp_control/packet_info_logic/ce_info_1]
create_bd_pin -dir O -from 0 -to 0 Res
create_bd_pin -dir I -from 0 -to 0 Op1
create_bd_pin -dir I -from 0 -to 0 Op2
create_bd_pin -dir I -from 0 -to 0 Op3

create_bd_cell -type ip -vlnv xilinx.com:ip:util_vector_logic:2.0 util_vector_logic_13
set_property -dict {CONFIG.C_OPERATION and CONFIG.C_SIZE 1} [get_bd_cells util_vector_logic_13]
create_bd_cell -type ip -vlnv xilinx.com:ip:util_vector_logic:2.0 util_vector_logic_8
set_property -dict {CONFIG.C_OPERATION and CONFIG.C_SIZE 1} [get_bd_cells util_vector_logic_8]
create_bd_cell -type ip -vlnv xilinx.com:ip:util_vector_logic:2.0 util_vector_logic_10
set_property -dict {CONFIG.C_OPERATION not CONFIG.C_SIZE 1} [get_bd_cells util_vector_logic_10]
create_bd_cell -type ip -vlnv xilinx.com:ip:util_vector_logic:2.0 util_vector_logic_11
set_property -dict {CONFIG.C_OPERATION not CONFIG.C_SIZE 1} [get_bd_cells util_vector_logic_11]

# ---- hierarchy /udp_control/packet_info_logic/ce_info_2 ----
current_bd_instance /udp_control/packet_info_logic/ce_info_2
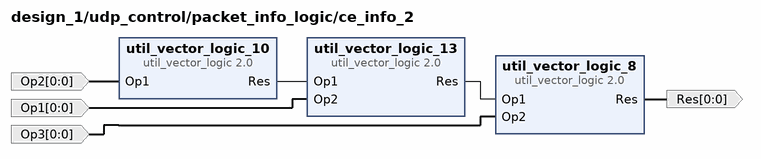
[diagram p43: block diagram inside /udp_control/packet_info_logic/ce_info_2]
create_bd_pin -dir O -from 0 -to 0 Res
create_bd_pin -dir I -from 0 -to 0 Op1
create_bd_pin -dir I -from 0 -to 0 Op2
create_bd_pin -dir I -from 0 -to 0 Op3

create_bd_cell -type ip -vlnv xilinx.com:ip:util_vector_logic:2.0 util_vector_logic_13
set_property -dict {CONFIG.C_OPERATION and CONFIG.C_SIZE 1} [get_bd_cells util_vector_logic_13]
create_bd_cell -type ip -vlnv xilinx.com:ip:util_vector_logic:2.0 util_vector_logic_8
set_property -dict {CONFIG.C_OPERATION and CONFIG.C_SIZE 1} [get_bd_cells util_vector_logic_8]
create_bd_cell -type ip -vlnv xilinx.com:ip:util_vector_logic:2.0 util_vector_logic_10
set_property -dict {CONFIG.C_OPERATION not CONFIG.C_SIZE 1} [get_bd_cells util_vector_logic_10]

# ---- hierarchy /udp_control/packet_info_logic/ce_info_3 ----
current_bd_instance /udp_control/packet_info_logic/ce_info_3
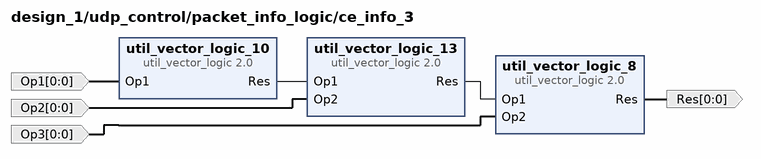
[diagram p44: block diagram inside /udp_control/packet_info_logic/ce_info_3]
create_bd_pin -dir O -from 0 -to 0 Res
create_bd_pin -dir I -from 0 -to 0 Op1
create_bd_pin -dir I -from 0 -to 0 Op2
create_bd_pin -dir I -from 0 -to 0 Op3

create_bd_cell -type ip -vlnv xilinx.com:ip:util_vector_logic:2.0 util_vector_logic_13
set_property -dict {CONFIG.C_OPERATION and CONFIG.C_SIZE 1} [get_bd_cells util_vector_logic_13]
create_bd_cell -type ip -vlnv xilinx.com:ip:util_vector_logic:2.0 util_vector_logic_8
set_property -dict {CONFIG.C_OPERATION and CONFIG.C_SIZE 1} [get_bd_cells util_vector_logic_8]
create_bd_cell -type ip -vlnv xilinx.com:ip:util_vector_logic:2.0 util_vector_logic_10
set_property -dict {CONFIG.C_OPERATION not CONFIG.C_SIZE 1} [get_bd_cells util_vector_logic_10]

# ---- hierarchy /udp_control/packet_info_logic/ce_info_4 ----
current_bd_instance /udp_control/packet_info_logic/ce_info_4
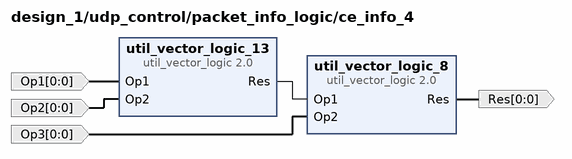
[diagram p45: block diagram inside /udp_control/packet_info_logic/ce_info_4]
create_bd_pin -dir O -from 0 -to 0 Res
create_bd_pin -dir I -from 0 -to 0 Op1
create_bd_pin -dir I -from 0 -to 0 Op2
create_bd_pin -dir I -from 0 -to 0 Op3

create_bd_cell -type ip -vlnv xilinx.com:ip:util_vector_logic:2.0 util_vector_logic_13
set_property -dict {CONFIG.C_OPERATION and CONFIG.C_SIZE 1} [get_bd_cells util_vector_logic_13]
create_bd_cell -type ip -vlnv xilinx.com:ip:util_vector_logic:2.0 util_vector_logic_8
set_property -dict {CONFIG.C_OPERATION and CONFIG.C_SIZE 1} [get_bd_cells util_vector_logic_8]

# ---- hierarchy /mapping_ADC_to_chan ----
current_bd_instance /mapping_ADC_to_chan
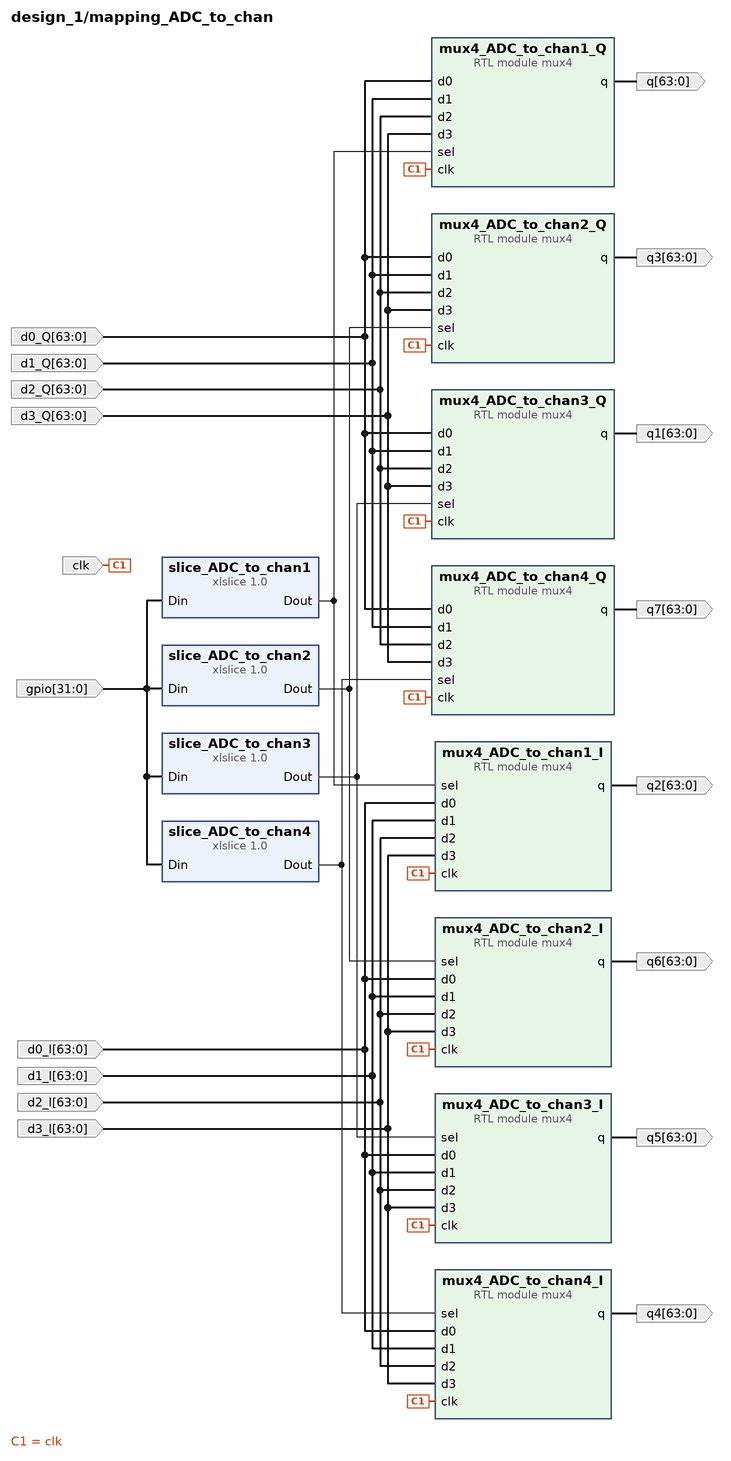
[diagram p46: block diagram inside /mapping_ADC_to_chan]
create_bd_pin -dir I -from 63 -to 0 d0_Q
create_bd_pin -dir I -from 63 -to 0 d1_Q
create_bd_pin -dir I -from 63 -to 0 d2_Q
create_bd_pin -dir I -from 63 -to 0 d3_Q
create_bd_pin -dir I -type clk clk
create_bd_pin -dir O -from 63 -to 0 q
create_bd_pin -dir O -from 63 -to 0 q1
create_bd_pin -dir I -from 63 -to 0 d0_I
create_bd_pin -dir I -from 63 -to 0 d1_I
create_bd_pin -dir I -from 63 -to 0 d2_I
create_bd_pin -dir I -from 63 -to 0 d3_I
create_bd_pin -dir O -from 63 -to 0 q2
create_bd_pin -dir O -from 63 -to 0 q3
create_bd_pin -dir O -from 63 -to 0 q4
create_bd_pin -dir O -from 63 -to 0 q5
create_bd_pin -dir I -from 31 -to 0 gpio
create_bd_pin -dir O -from 63 -to 0 q6
create_bd_pin -dir O -from 63 -to 0 q7

create_bd_cell -type ip -vlnv xilinx.com:ip:xlslice:1.0 slice_ADC_to_chan1
set_property -dict {CONFIG.DIN_FROM 9 CONFIG.DIN_TO 8 CONFIG.DOUT_WIDTH 2} [get_bd_cells slice_ADC_to_chan1]
create_bd_cell -type ip -vlnv xilinx.com:ip:xlslice:1.0 slice_ADC_to_chan2
set_property -dict {CONFIG.DIN_FROM 11 CONFIG.DIN_TO 10 CONFIG.DOUT_WIDTH 2} [get_bd_cells slice_ADC_to_chan2]
create_bd_cell -type ip -vlnv xilinx.com:ip:xlslice:1.0 slice_ADC_to_chan3
set_property -dict {CONFIG.DIN_FROM 13 CONFIG.DIN_TO 12 CONFIG.DOUT_WIDTH 2} [get_bd_cells slice_ADC_to_chan3]
create_bd_cell -type ip -vlnv xilinx.com:ip:xlslice:1.0 slice_ADC_to_chan4
set_property -dict {CONFIG.DIN_FROM 15 CONFIG.DIN_TO 14 CONFIG.DOUT_WIDTH 2} [get_bd_cells slice_ADC_to_chan4]
create_bd_cell -type module -reference mux4 mux4_ADC_to_chan4_Q
set_property -dict {CONFIG.width 64} [get_bd_cells mux4_ADC_to_chan4_Q]
create_bd_cell -type module -reference mux4 mux4_ADC_to_chan3_I
set_property -dict {CONFIG.width 64} [get_bd_cells mux4_ADC_to_chan3_I]
create_bd_cell -type module -reference mux4 mux4_ADC_to_chan3_Q
set_property -dict {CONFIG.width 64} [get_bd_cells mux4_ADC_to_chan3_Q]
create_bd_cell -type module -reference mux4 mux4_ADC_to_chan4_I
set_property -dict {CONFIG.width 64} [get_bd_cells mux4_ADC_to_chan4_I]
create_bd_cell -type module -reference mux4 mux4_ADC_to_chan1_I
set_property -dict {CONFIG.width 64} [get_bd_cells mux4_ADC_to_chan1_I]
create_bd_cell -type module -reference mux4 mux4_ADC_to_chan1_Q
set_property -dict {CONFIG.width 64} [get_bd_cells mux4_ADC_to_chan1_Q]
create_bd_cell -type module -reference mux4 mux4_ADC_to_chan2_I
set_property -dict {CONFIG.width 64} [get_bd_cells mux4_ADC_to_chan2_I]
create_bd_cell -type module -reference mux4 mux4_ADC_to_chan2_Q
set_property -dict {CONFIG.width 64} [get_bd_cells mux4_ADC_to_chan2_Q]

# ---- hierarchy /mapping_chan_to_DAC ----
current_bd_instance /mapping_chan_to_DAC
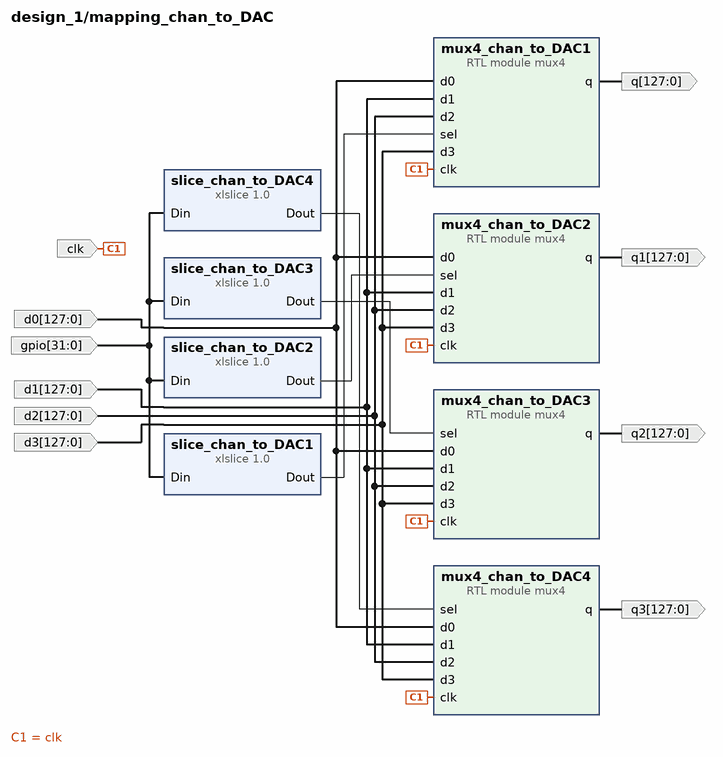
[diagram p47: block diagram inside /mapping_chan_to_DAC]
create_bd_pin -dir I -from 127 -to 0 d0
create_bd_pin -dir I -from 127 -to 0 d1
create_bd_pin -dir I -from 127 -to 0 d2
create_bd_pin -dir I -from 127 -to 0 d3
create_bd_pin -dir I -type clk clk
create_bd_pin -dir O -from 127 -to 0 q
create_bd_pin -dir I -from 31 -to 0 gpio
create_bd_pin -dir O -from 127 -to 0 q1
create_bd_pin -dir O -from 127 -to 0 q2
create_bd_pin -dir O -from 127 -to 0 q3

create_bd_cell -type ip -vlnv xilinx.com:ip:xlslice:1.0 slice_chan_to_DAC1
set_property -dict {CONFIG.DIN_FROM 1 CONFIG.DIN_TO 0 CONFIG.DOUT_WIDTH 2} [get_bd_cells slice_chan_to_DAC1]
create_bd_cell -type ip -vlnv xilinx.com:ip:xlslice:1.0 slice_chan_to_DAC2
set_property -dict {CONFIG.DIN_FROM 3 CONFIG.DIN_TO 2 CONFIG.DOUT_WIDTH 2} [get_bd_cells slice_chan_to_DAC2]
create_bd_cell -type ip -vlnv xilinx.com:ip:xlslice:1.0 slice_chan_to_DAC3
set_property -dict {CONFIG.DIN_FROM 5 CONFIG.DIN_TO 4 CONFIG.DOUT_WIDTH 2} [get_bd_cells slice_chan_to_DAC3]
create_bd_cell -type ip -vlnv xilinx.com:ip:xlslice:1.0 slice_chan_to_DAC4
set_property -dict {CONFIG.DIN_FROM 7 CONFIG.DIN_TO 6 CONFIG.DOUT_WIDTH 2} [get_bd_cells slice_chan_to_DAC4]
create_bd_cell -type module -reference mux4 mux4_chan_to_DAC2
set_property -dict {CONFIG.width 128} [get_bd_cells mux4_chan_to_DAC2]
create_bd_cell -type module -reference mux4 mux4_chan_to_DAC3
set_property -dict {CONFIG.width 128} [get_bd_cells mux4_chan_to_DAC3]
create_bd_cell -type module -reference mux4 mux4_chan_to_DAC4
set_property -dict {CONFIG.width 128} [get_bd_cells mux4_chan_to_DAC4]
create_bd_cell -type module -reference mux4 mux4_chan_to_DAC1
set_property -dict {CONFIG.width 128} [get_bd_cells mux4_chan_to_DAC1]

# ---- connections ----

current_bd_instance /ethWrapPort0
connect_bd_intf_net [get_bd_intf_pins S00_AXI] [get_bd_intf_pins eth_regs_0/S00_AXI]
connect_bd_net [get_bd_pins clk_125] \
  [get_bd_pins blk_mem_gen_0/clkb] [get_bd_pins c_shift_ram_0/CLK] [get_bd_pins c_accum_0/CLK] \
  [get_bd_pins eth_buffer_0/clk_eth]
connect_bd_net [get_bd_pins blk_mem_gen_0/doutb] [get_bd_pins eth_buffer_0/r_data]
connect_bd_net [get_bd_pins c_accum_0/Q] [get_bd_pins Q_packet_count]
connect_bd_net [get_bd_pins c_shift_ram_0/Q] [get_bd_pins Q_data_byte]
connect_bd_net -net chan1_accum_snap_sync [get_bd_pins start] [get_bd_pins eth_buffer_0/start]
connect_bd_net -net clk_wiz_0_clk_out1 [get_bd_pins clk_256] [get_bd_pins blk_mem_gen_0/clka] [get_bd_pins eth_buffer_0/clk_fab]
connect_bd_net [get_bd_pins dina] [get_bd_pins blk_mem_gen_0/dina]
connect_bd_net [get_bd_pins eth_buffer_0/data_byte] [get_bd_pins c_shift_ram_0/D]
connect_bd_net [get_bd_pins eth_buffer_0/eth_start_trig] [get_bd_pins c_accum_0/B] [get_bd_pins eth_start_trig]
connect_bd_net [get_bd_pins eth_buffer_0/r_data_addr] [get_bd_pins blk_mem_gen_0/addrb]
connect_bd_net [get_bd_pins eth_buffer_0/r_data_en] [get_bd_pins blk_mem_gen_0/enb]
connect_bd_net [get_bd_pins eth_buffer_0/w_data_addr] [get_bd_pins blk_mem_gen_0/addra]
connect_bd_net [get_bd_pins eth_buffer_0/w_data_en] [get_bd_pins blk_mem_gen_0/ena] [get_bd_pins blk_mem_gen_0/wea]
connect_bd_net [get_bd_pins eth_regs_0/dst_ip] [get_bd_pins dst_ip]
connect_bd_net [get_bd_pins eth_regs_0/dst_mac] [get_bd_pins dst_mac]
connect_bd_net [get_bd_pins eth_regs_0/src_ip] [get_bd_pins src_ip]
connect_bd_net [get_bd_pins eth_regs_0/src_mac] [get_bd_pins src_mac]
connect_bd_net [get_bd_pins r_max_count/dout] [get_bd_pins eth_buffer_0/r_max_count]
connect_bd_net -net rst_ps8_0_99M1_peripheral_aresetn [get_bd_pins s_axi_aresetn99] [get_bd_pins eth_regs_0/s00_axi_aresetn]
connect_bd_net -net s00_axi_aclk_1 [get_bd_pins s_axi_aclk99] [get_bd_pins eth_regs_0/s00_axi_aclk]
connect_bd_net -net xlconstant_1_dout [get_bd_pins w_max_count/dout] [get_bd_pins eth_buffer_0/w_max_count]

current_bd_instance /chan1
connect_bd_intf_net [get_bd_intf_pins S_AXI_bram_ctrl_0] [get_bd_intf_pins snap_data_capture/S_AXI_bram_ctrl_0]
connect_bd_intf_net [get_bd_intf_pins S_AXI_bram_ctrl_1] [get_bd_intf_pins snap_data_capture/S_AXI_bram_ctrl_1]
connect_bd_intf_net [get_bd_intf_pins S_AXI_gpio_0] [get_bd_intf_pins GPIO/S_AXI_gpio_0]
connect_bd_intf_net [get_bd_intf_pins S_AXI_gpio_1] [get_bd_intf_pins GPIO/S_AXI_gpio_1]
connect_bd_intf_net [get_bd_intf_pins S_AXI_gpio_2] [get_bd_intf_pins GPIO/S_AXI_gpio_2]
connect_bd_intf_net [get_bd_intf_pins S_AXI_gpio_3] [get_bd_intf_pins GPIO/S_AXI_gpio_3]
connect_bd_intf_net [get_bd_intf_pins S_AXI_gpio_4] [get_bd_intf_pins GPIO/S_AXI_gpio_4]
connect_bd_intf_net [get_bd_intf_pins S_AXI_gpio_5] [get_bd_intf_pins GPIO/S_AXI_gpio_5]
connect_bd_intf_net [get_bd_intf_pins S_AXI_gpio_6] [get_bd_intf_pins GPIO/S_AXI_gpio_6]
connect_bd_intf_net [get_bd_intf_pins S_AXI_gpio_7] [get_bd_intf_pins GPIO/S_AXI_gpio_7]
connect_bd_intf_net [get_bd_intf_pins S_AXI_gpio_8] [get_bd_intf_pins GPIO/S_AXI_gpio_8]
connect_bd_intf_net [get_bd_intf_pins S_AXI_gpio_9] [get_bd_intf_pins GPIO/S_AXI_gpio_9]
connect_bd_intf_net [get_bd_intf_pins S_AXI_gpio_10] [get_bd_intf_pins GPIO/S_AXI_gpio_10]
connect_bd_net [get_bd_pins GPIO/ov_rst] [get_bd_pins overflow_management/ov_rst]
connect_bd_net [get_bd_pins ADC_data_im] [get_bd_pins fine_nco/ADC_data_im] [get_bd_pins snap_data_capture/ADC_data_im]
connect_bd_net [get_bd_pins ADC_data_re] [get_bd_pins fine_nco/ADC_data_re] [get_bd_pins snap_data_capture/ADC_data_re]
connect_bd_net -net clk_wiz_0_clk_out1 [get_bd_pins CLK] \
  [get_bd_pins c_shift_ram_4/CLK] [get_bd_pins psb3_0_0/clk] [get_bd_pins psb_out_post/clk] [get_bd_pins fine_nco/clk_256M] \
  [get_bd_pins snap_data_capture/clk_256M] [get_bd_pins receive1_3_0/clk] [get_bd_pins overflow_management/CLK]
connect_bd_net -net cordic_mix_v2_ADC_out_im_0 [get_bd_pins fine_nco/out_im_0] [get_bd_pins receive1_3_0/in_re_0]
connect_bd_net -net cordic_mix_v2_ADC_out_im_1 [get_bd_pins fine_nco/out_im_1] [get_bd_pins receive1_3_0/in_re_1]
connect_bd_net -net cordic_mix_v2_ADC_out_im_2 [get_bd_pins fine_nco/out_im_2] [get_bd_pins receive1_3_0/in_re_2]
connect_bd_net -net cordic_mix_v2_ADC_out_im_3 [get_bd_pins fine_nco/out_im_3] [get_bd_pins receive1_3_0/in_re_3]
connect_bd_net -net cordic_mix_v2_ADC_out_re_0 [get_bd_pins fine_nco/out_re_0] [get_bd_pins receive1_3_0/in_im_0]
connect_bd_net -net cordic_mix_v2_ADC_out_re_1 [get_bd_pins fine_nco/out_re_1] [get_bd_pins receive1_3_0/in_im_1]
connect_bd_net -net cordic_mix_v2_ADC_out_re_2 [get_bd_pins fine_nco/out_re_2] [get_bd_pins receive1_3_0/in_im_2]
connect_bd_net -net cordic_mix_v2_ADC_out_re_3 [get_bd_pins fine_nco/out_re_3] [get_bd_pins receive1_3_0/in_im_3]
connect_bd_net [get_bd_pins overflow_management/dout] [get_bd_pins GPIO/dsp_ov_flag]
connect_bd_net -net proc_sys_reset_0_peripheral_aresetn [get_bd_pins s_axi_aresetn256] [get_bd_pins snap_data_capture/s_axi_aresetn256]
connect_bd_net -net psb2_0_0_gout_psb_tvalid [get_bd_pins c_shift_ram_4/Q] [get_bd_pins receive1_3_0/in_tvalid]
connect_bd_net [get_bd_pins psb3_0_0/gout_ov_add] [get_bd_pins overflow_management/ov_add]
connect_bd_net [get_bd_pins psb3_0_0/gout_ov_ifft] [get_bd_pins overflow_management/ov_ifft]
connect_bd_net [get_bd_pins psb3_0_0/gout_psb_tvalid] [get_bd_pins c_shift_ram_4/D]
connect_bd_net -net psb_im0_1 [get_bd_pins psb3_0_0/gout_psb_im_0] [get_bd_pins psb_out_post/psb_im0]
connect_bd_net -net psb_im1_1 [get_bd_pins psb3_0_0/gout_psb_im_1] [get_bd_pins psb_out_post/psb_im1]
connect_bd_net -net psb_im2_1 [get_bd_pins psb3_0_0/gout_psb_im_2] [get_bd_pins psb_out_post/psb_im2]
connect_bd_net -net psb_im3_1 [get_bd_pins psb3_0_0/gout_psb_im_3] [get_bd_pins psb_out_post/psb_im3]
connect_bd_net [get_bd_pins psb_out_post/ov] [get_bd_pins overflow_management/ov_postPSB]
connect_bd_net -net psb_re0_1 [get_bd_pins psb3_0_0/gout_psb_re_0] [get_bd_pins psb_out_post/psb_re0]
connect_bd_net -net psb_re1_1 [get_bd_pins psb3_0_0/gout_psb_re_1] [get_bd_pins psb_out_post/psb_re1]
connect_bd_net -net psb_re2_1 [get_bd_pins psb3_0_0/gout_psb_re_2] [get_bd_pins psb_out_post/psb_re2]
connect_bd_net -net psb_re3_1 [get_bd_pins psb3_0_0/gout_psb_re_3] [get_bd_pins psb_out_post/psb_re3]
connect_bd_net [get_bd_pins receive1_3_0/acc_tvalid] [get_bd_pins snap_data_capture/tvalid]
connect_bd_net [get_bd_pins receive1_3_0/acc_tvalid_eth] [get_bd_pins acc_tvalid_eth]
connect_bd_net [get_bd_pins receive1_3_0/snap_i0] [get_bd_pins xlconcat_1/In0]
connect_bd_net [get_bd_pins receive1_3_0/snap_i1] [get_bd_pins xlconcat_1/In2]
connect_bd_net [get_bd_pins receive1_3_0/snap_i2] [get_bd_pins xlconcat_1/In4]
connect_bd_net [get_bd_pins receive1_3_0/snap_i3] [get_bd_pins xlconcat_1/In6]
connect_bd_net [get_bd_pins receive1_3_0/snap_q0] [get_bd_pins xlconcat_1/In1]
connect_bd_net [get_bd_pins receive1_3_0/snap_q1] [get_bd_pins xlconcat_1/In3]
connect_bd_net [get_bd_pins receive1_3_0/snap_q2] [get_bd_pins xlconcat_1/In5]
connect_bd_net [get_bd_pins receive1_3_0/snap_q3] [get_bd_pins xlconcat_1/In7]
connect_bd_net -net reset_Dout [get_bd_pins GPIO/psb_rst] [get_bd_pins psb3_0_0/gin_tl_reset]
connect_bd_net -net rst_ps8_0_99M_peripheral_aresetn [get_bd_pins s_axi_aresetn99] [get_bd_pins GPIO/s_axi_aresetn]
connect_bd_net -net scale_const16_1 [get_bd_pins GPIO/psb_postScale] [get_bd_pins psb_out_post/scale_const16]
connect_bd_net -net scaler_16bits_1_psb_dac_im0 [get_bd_pins psb_out_post/psb_dac_im0] [get_bd_pins fine_nco/DAC_im_0]
connect_bd_net -net scaler_16bits_1_psb_dac_im1 [get_bd_pins psb_out_post/psb_dac_im1] [get_bd_pins fine_nco/DAC_im_1]
connect_bd_net -net scaler_16bits_1_psb_dac_im2 [get_bd_pins psb_out_post/psb_dac_im2] [get_bd_pins fine_nco/DAC_im_2]
connect_bd_net -net scaler_16bits_1_psb_dac_im3 [get_bd_pins psb_out_post/psb_dac_im3] [get_bd_pins fine_nco/DAC_im_3]
connect_bd_net -net scaler_16bits_1_psb_dac_re0 [get_bd_pins psb_out_post/psb_dac_re0] [get_bd_pins fine_nco/DAC_re_0]
connect_bd_net -net scaler_16bits_1_psb_dac_re1 [get_bd_pins psb_out_post/psb_dac_re1] [get_bd_pins fine_nco/DAC_re_1]
connect_bd_net -net scaler_16bits_1_psb_dac_re2 [get_bd_pins psb_out_post/psb_dac_re2] [get_bd_pins fine_nco/DAC_re_2]
connect_bd_net -net scaler_16bits_1_psb_dac_re3 [get_bd_pins psb_out_post/psb_dac_re3] [get_bd_pins fine_nco/DAC_re_3]
connect_bd_net -net start_Dout [get_bd_pins GPIO/psb_start] [get_bd_pins psb3_0_0/gin_tl_start] [get_bd_pins start_chan1]
connect_bd_net -net we_even_1_Dout [get_bd_pins GPIO/psb_tone_we_even1] [get_bd_pins psb3_0_0/gin_we_even_1]
connect_bd_net -net we_even_2_Dout [get_bd_pins GPIO/psb_tone_we_even2] [get_bd_pins psb3_0_0/gin_we_even_2]
connect_bd_net -net we_even_3_Dout [get_bd_pins GPIO/psb_tone_we_even3] [get_bd_pins psb3_0_0/gin_we_even_3]
connect_bd_net -net we_even_4_Dout [get_bd_pins GPIO/psb_tone_we_even4] [get_bd_pins psb3_0_0/gin_we_even_4]
connect_bd_net -net we_odd_10_Dout [get_bd_pins GPIO/psb_toneSelect_w_D3] [get_bd_pins psb3_0_0/ts_3]
connect_bd_net -net we_odd_11_Dout [get_bd_pins GPIO/psb_toneSelect_w_D4] [get_bd_pins psb3_0_0/ts_4]
connect_bd_net -net we_odd_12_Dout [get_bd_pins GPIO/psb_toneSelect_w_D5] [get_bd_pins psb3_0_0/ts_5]
connect_bd_net -net we_odd_13_Dout [get_bd_pins GPIO/psb_toneSelect_w_D6] [get_bd_pins psb3_0_0/ts_6]
connect_bd_net -net we_odd_14_Dout [get_bd_pins GPIO/psb_toneSelect_w_D7] [get_bd_pins psb3_0_0/ts_7]
connect_bd_net -net we_odd_1_Dout [get_bd_pins GPIO/psb_tone_we_odd1] [get_bd_pins psb3_0_0/gin_we_odd_1]
connect_bd_net -net we_odd_2_Dout [get_bd_pins GPIO/psb_tone_we_odd2] [get_bd_pins psb3_0_0/gin_we_odd_2]
connect_bd_net -net we_odd_3_Dout [get_bd_pins GPIO/psb_tone_we_odd3] [get_bd_pins psb3_0_0/gin_we_odd_3]
connect_bd_net -net we_odd_4_Dout [get_bd_pins GPIO/psb_tone_we_odd4] [get_bd_pins psb3_0_0/gin_we_odd_4]
connect_bd_net -net we_odd_5_Dout [get_bd_pins GPIO/psb_toneSelect_we] [get_bd_pins psb3_0_0/ts_w]
connect_bd_net -net we_odd_6_Dout [get_bd_pins GPIO/psb_toneSelect_w_addr] [get_bd_pins psb3_0_0/ts_a]
connect_bd_net -net we_odd_7_Dout [get_bd_pins GPIO/psb_toneSelect_w_D0] [get_bd_pins psb3_0_0/ts_0]
connect_bd_net -net we_odd_8_Dout [get_bd_pins GPIO/psb_toneSelect_w_D1] [get_bd_pins psb3_0_0/ts_1]
connect_bd_net -net we_odd_9_Dout [get_bd_pins GPIO/psb_toneSelect_w_D2] [get_bd_pins psb3_0_0/ts_2]
connect_bd_net -net xlconcat_0_dout [get_bd_pins fine_nco/to_DAC] [get_bd_pins to_DAC] [get_bd_pins snap_data_capture/DAC_data]
connect_bd_net [get_bd_pins xlconcat_1/dout] [get_bd_pins timestream_out] [get_bd_pins snap_data_capture/rec_output]
connect_bd_net [get_bd_pins xlconstant_7/dout] [get_bd_pins fine_nco/sync_in]
connect_bd_net -net xlslice_0_Dout [get_bd_pins GPIO/psb_tone_w_init_re] [get_bd_pins psb3_0_0/gin_init_re]
connect_bd_net -net xlslice_1_Dout [get_bd_pins GPIO/psb_tone_w_init_im] [get_bd_pins psb3_0_0/gin_init_im]
connect_bd_net -net xlslice_3_Dout [get_bd_pins GPIO/psb_tone_w_addr] [get_bd_pins psb3_0_0/gin_addr]
connect_bd_net -net xlslice_4_Dout [get_bd_pins GPIO/psb_tone_w_dphi] [get_bd_pins psb3_0_0/gin_dphi]
connect_bd_net -net xlslice_5_Dout [get_bd_pins GPIO/rec_acc_length] [get_bd_pins receive1_3_0/acc_length]
connect_bd_net -net xlslice_beat_addr_Dout [get_bd_pins GPIO/rec_beatDphi_w_addr] [get_bd_pins receive1_3_0/w_beat_addr]
connect_bd_net -net xlslice_beat_dphi_Dout [get_bd_pins GPIO/rec_beatDphi_w_D] [get_bd_pins receive1_3_0/w_beat_dphi]
connect_bd_net -net xlslice_beat_we0_Dout [get_bd_pins GPIO/rec_beatDphi_we0] [get_bd_pins receive1_3_0/beat_we0]
connect_bd_net -net xlslice_beat_we1_Dout [get_bd_pins GPIO/rec_beatDphi_we1] [get_bd_pins receive1_3_0/beat_we1]
connect_bd_net -net xlslice_beat_we2_Dout [get_bd_pins GPIO/rec_beatDphi_we2] [get_bd_pins receive1_3_0/beat_we2]
connect_bd_net -net xlslice_beat_we3_Dout [get_bd_pins GPIO/rec_beatDphi_we3] [get_bd_pins receive1_3_0/beat_we3]
connect_bd_net -net xlslice_bin_sel_addr_Dout [get_bd_pins GPIO/rec_binSelect_w_addr] [get_bd_pins receive1_3_0/w_binsel_addr]
connect_bd_net -net xlslice_bin_sel_data1_Dout [get_bd_pins GPIO/rec_binSelect_w_D1] [get_bd_pins receive1_3_0/w_binsel_data1]
connect_bd_net -net xlslice_bin_sel_data_Dout [get_bd_pins GPIO/rec_binSelect_w_D0] [get_bd_pins receive1_3_0/w_binsel_data0]
connect_bd_net -net xlslice_bin_sel_we_Dout [get_bd_pins GPIO/rec_binSelect_we] [get_bd_pins receive1_3_0/binsel_we]
connect_bd_net -net xlslice_bram_rst_Dout [get_bd_pins GPIO/getAccumCtrl_rst] [get_bd_pins snap_data_capture/getAccumCtrl_rst]
connect_bd_net -net xlslice_bramx32v2_start_Dout [get_bd_pins GPIO/axibramx32v2_start] [get_bd_pins snap_data_capture/axibramx32v2_start]
connect_bd_net -net xlslice_dacmix_dp_Dout [get_bd_pins GPIO/fineNCO_dphi] [get_bd_pins fine_nco/dphi]
connect_bd_net -net xlslice_fft_scale_Dout [get_bd_pins GPIO/rec_fft_scale] [get_bd_pins receive1_3_0/fft_scale]
connect_bd_net -net xlslice_getAccumChan_Dout [get_bd_pins GPIO/getAccum_channel_count] [get_bd_pins snap_data_capture/max_chan_minus_three]
connect_bd_net -net zynq_ultra_ps_e_0_pl_clk0 [get_bd_pins s_axi_aclk99] [get_bd_pins GPIO/s_axi_aclk]
